# Altium schematic sheet [03] - RF_433.SchDoc
size A3; DocumentNumber: 2; SheetNumber: 2; SheetTotal: 4
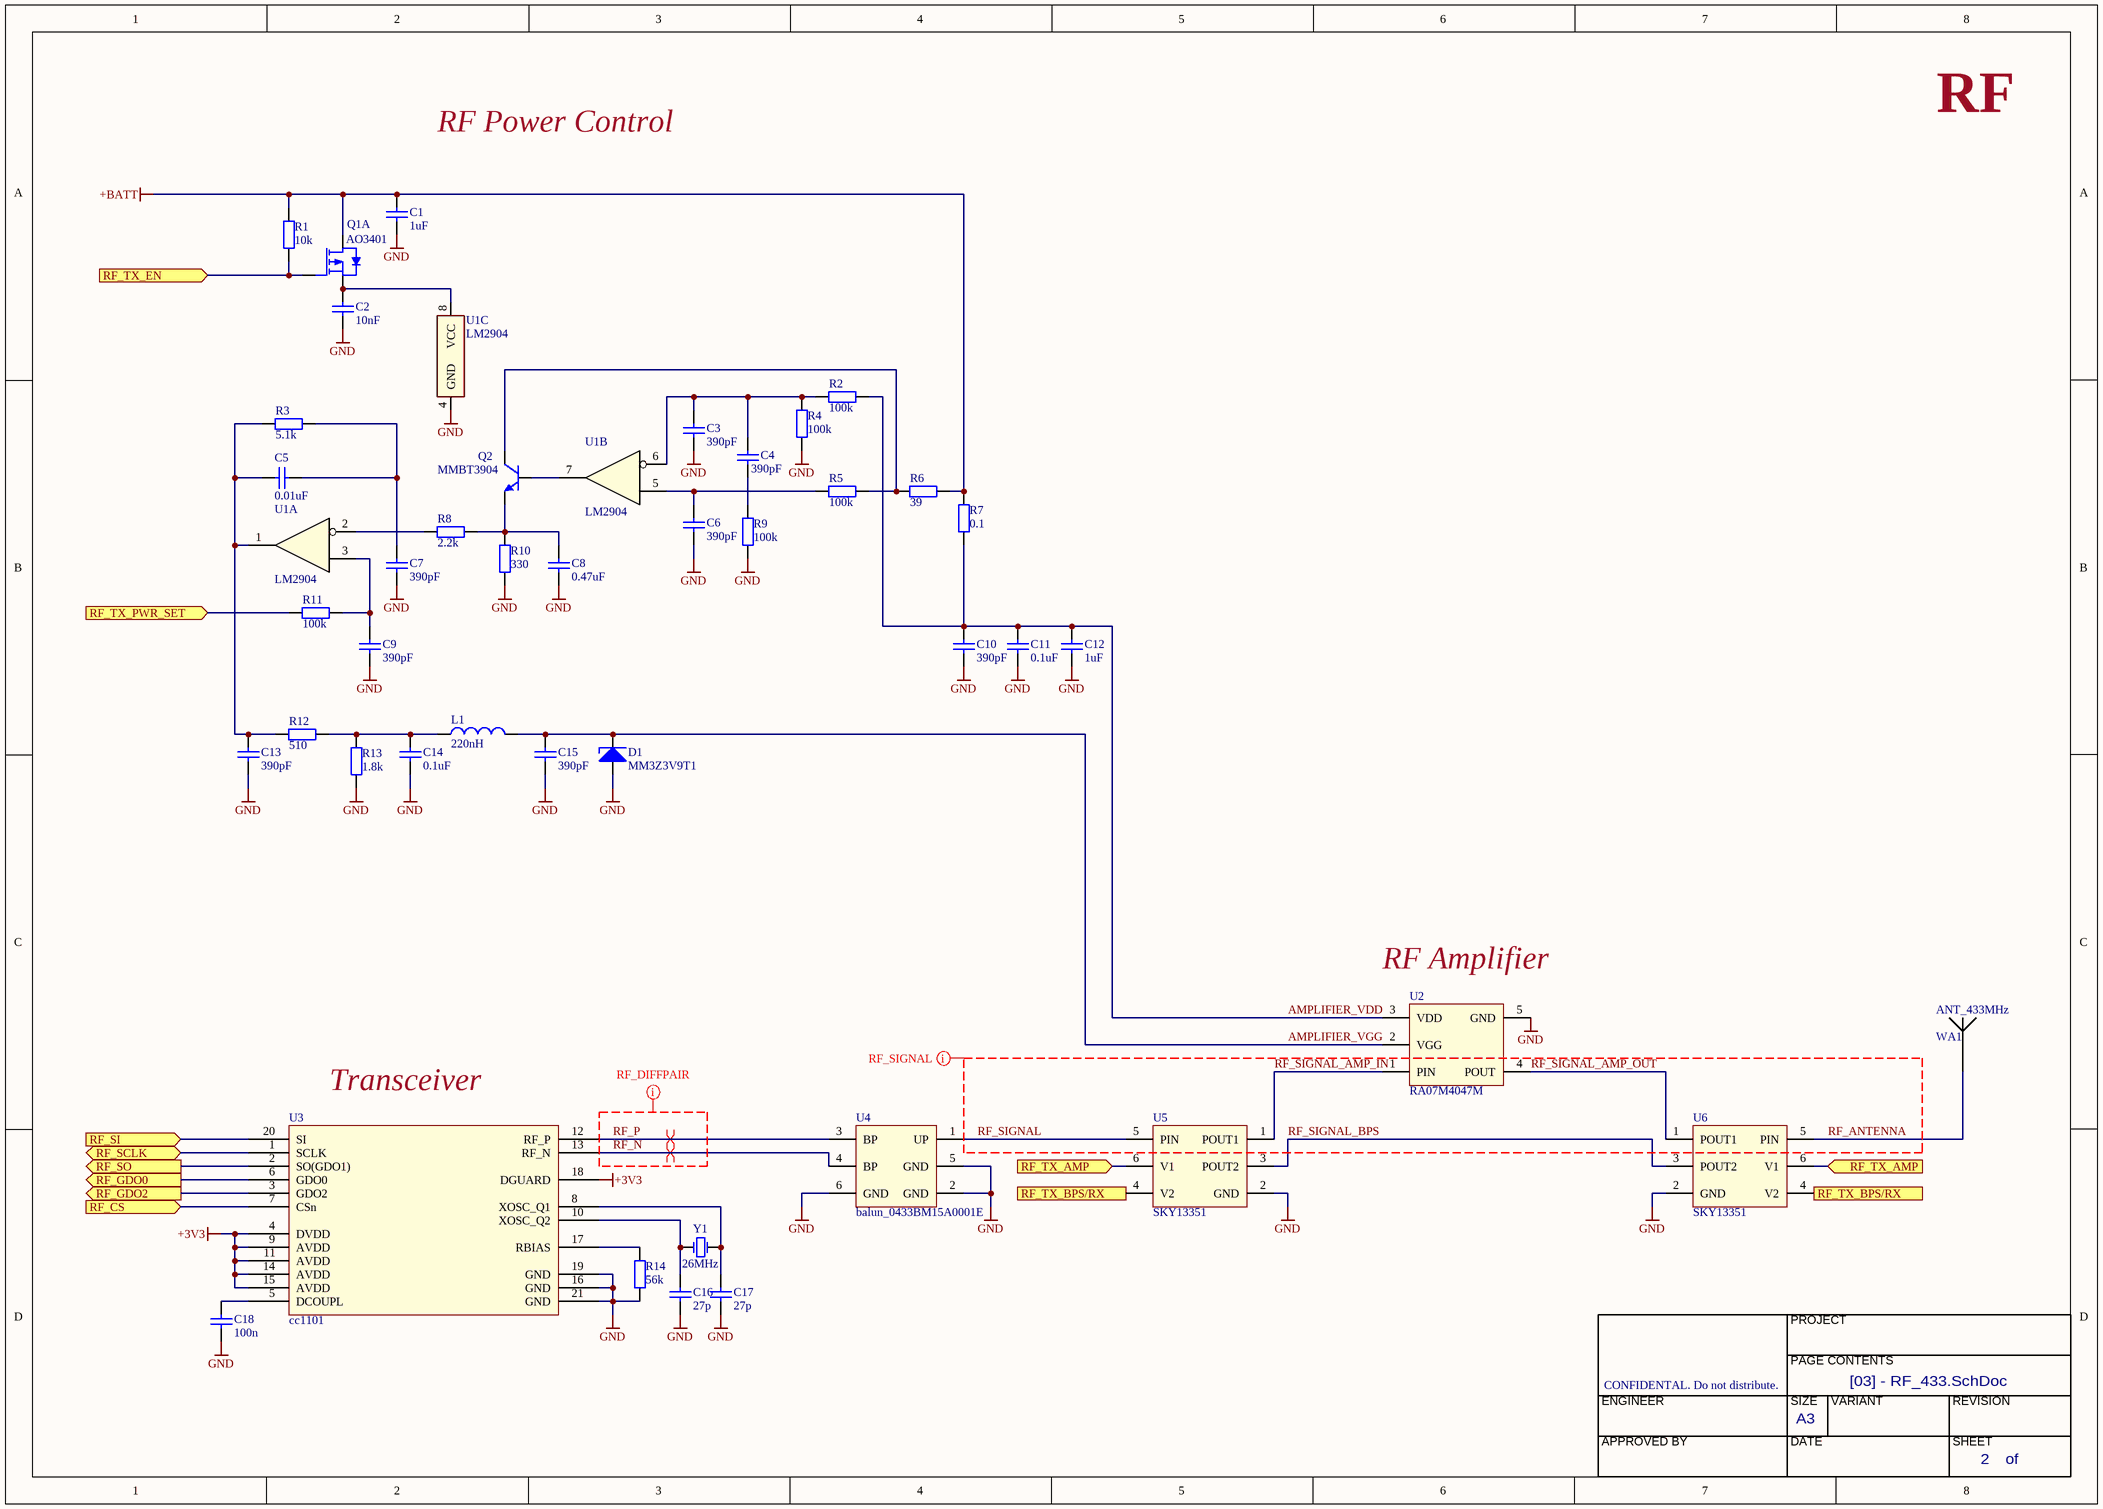
[diagram p0: [03] - RF_433.SchDoc]

## Parts
C1  1uF  [CAP0402]
C2  10nF  [CAP0402]
C3  390pF  [CAP0402]
C4  390pF  [CAP0402]
C5  0.01uF  [CAP0402]
C6  390pF  [CAP0402]
C7  390pF  [CAP0402]
C8  0.47uF  [CAP0402]
C9  390pF  [CAP0402]
C10  390pF  [CAP0402]
C11  0.1uF  [CAP0402]
C12  1uF  [CAP0402]
C13  390pF  [CAP0402]
C14  0.1uF  [CAP0402]
C15  390pF  [CAP0402]
C16  27p  [CAP0402]
C17  27p  [CAP0402]
C18  100n  [CAP0402]
D1  MM3Z3V9T1  [SOD123]
L1  220nH  [INDC0603-0201]
Q1  AO3401  [SOIC127P600-8AM]  (part A of 2)
Q2  MMBT3904  [SO-G3]
R1  10k  [RES0402]
R2  100k  [RES0805]
R3  5.1k  [RES0805]
R4  100k  [RES0805]
R5  100k  [RES0805]
R6  39  [RES0805]
R7  0.1  [RES0805]
R8  2.2k  [RES0805]
R9  100k  [RES0805]
R10  330  [RES0805]
R11  100k  [RES0805]
R12  510  [RES0805]
R13  1.8k  [RES0805]
R14  56k  [RES0805]
U1  LM2904  [SOIC8]  (parts A,B,C of 3)
U2  RA07M4047M
U3  cc1101
U4  balun_0433BM15A0001E
U5  SKY13351
U6  SKY13351
WA1  ANT_433MHz
Y1  26MHz  [HC49/4H_SMX]

## Ports
RF_CS (in), RF_GDO0 (out), RF_GDO2 (out), RF_SCLK (bidir), RF_SI (in), RF_SO (out), RF_TX_AMP (in), RF_TX_BPS/RX (in), RF_TX_EN (in), RF_TX_PWR_SET (in)

## Nets
+3V3: U3.4(DVDD) U3.9(AVDD) U3.11(AVDD) U3.14(AVDD) U3.15(AVDD) U3.18(DGUARD)
+BATT: C1.1 Q1.D1 R1.2 R6.1 R7.2
GND: C1.2 C2.1 C3.1 C6.1 C7.1 C8.1 C9.1 C10.1 C11.1 C12.1 C13.1 C14.1 C15.1 C16.2 C17.2 C18.2 D1.A R4.1 R9.1 R10.1 R13.1 R14.1 U1.4(GND) U2.5(GND) U3.16(GND) U3.19(GND) U3.21(GND) U4.2(GND) U4.5(GND) U4.6(GND) U5.2(GND) U6.2(GND)
AMPLIFIER_VDD: C10.2 C11.2 C12.2 R2.1 R7.1 U2.3(VDD)
AMPLIFIER_VGG: C15.2 D1.C L1.2 U2.2(VGG)
RF_ANTENNA: U6.5(PIN) WA1.1
RF_CS: U3.7(CSn) ; port RF_CS
RF_GDO0: U3.6(GDO0) ; port RF_GDO0
RF_GDO2: U3.3(GDO2) ; port RF_GDO2
RF_N: U3.13(RF_N) U4.4(BP)
RF_P: U3.12(RF_P) U4.3(BP)
RF_SCLK: U3.1(SCLK) ; port RF_SCLK
RF_SI: U3.20(SI) ; port RF_SI
RF_SIGNAL: U4.1(UP) U5.5(PIN)
RF_SIGNAL_AMP_IN: U2.1(PIN) U5.1(POUT1)
RF_SIGNAL_AMP_OUT: U2.4(POUT) U6.1(POUT1)
RF_SIGNAL_BPS: U5.3(POUT2) U6.3(POUT2)
RF_SO: U3.2(SO(GDO1)) ; port RF_SO
RF_TX_AMP: U5.6(V1) U6.6(V1) ; port RF_TX_AMP
RF_TX_BPS/RX: U5.4(V2) U6.4(V2) ; port RF_TX_BPS/RX
RF_TX_EN: Q1.G1 R1.1 ; port RF_TX_EN
RF_TX_PWR_SET: R11.2 ; port RF_TX_PWR_SET
NetC2_2: C2.2 Q1.S1 U1.8(VCC)
NetC3_2: C3.2 C4.2 R2.2 R4.2 U1.6(IN-)
NetC4_1: C4.1 R9.2
NetC5_1: C5.1 C7.2 R3.1
NetC5_2: C5.2 C13.2 R3.2 R12.2 U1.1(OUT)
NetC6_2: C6.2 R5.2 U1.5(IN+)
NetC8_2: C8.2 Q2.E R8.1 R10.2
NetC9_2: C9.2 R11.1 U1.3(IN+)
NetC14_2: C14.2 L1.1 R12.1 R13.2
NetC16_1: C16.1 U3.10(XOSC_Q2) Y1.1(OSC1)
NetC17_1: C17.1 U3.8(XOSC_Q1) Y1.2(OSC2)
NetC18_1: C18.1 U3.5(DCOUPL)
NetQ2_B: Q2.B U1.7(OUT)
NetQ2_C: Q2.C R5.1 R6.2
NetR8_2: R8.2 U1.2(IN-)
NetR14_2: R14.2 U3.17(RBIAS)

## Layout directives
differential pair: RF_N, RF_P
net class RF_SIGNAL: RF_ANTENNA, RF_SIGNAL, RF_SIGNAL_AMP_IN, RF_SIGNAL_AMP_OUT, RF_SIGNAL_BPS
net class RF_DIFFPAIR: RF_N, RF_P

## Notes on the sheet
- RF Power Control
- RF
- (near U2) RF Amplifier
- (near U3) Transceiver
- PROJECT
- CONFIDENTAL. Do not distribute.
- PAGE CONTENTS
- ENGINEER
- APPROVED BY
- SIZE
- DATE
- A3
- VARIANT
- REVISION
- SHEET
- of

## Library data of the parts
C1-C18 = Cap: Capacitor; Manufacturer: *; Manufacturer Part Number: *; Supplier 1: Digi-Key; Supplier Part Number 1: *
D1 = Diode_Zener: Zener Diode; pin to pad: A>1 C>2; Manufacturer: *; Manufacturer Part Number: *; Supplier 1: Digi-Key; Supplier Part Number 1: *
L1 = Inductor: DigiKey: *
Q1 = MOSFET-P dual: P-Channel Power MOSFET; pin to pad: D1>7+8 D2>5+6 G1>2 G2>4 S1>1 S2>3; DigiKey: *
Q2 = NPN: NPN Bipolar Transistor; pin to pad: B>1 C>3 E>2; Manufacturer: *; Manufacturer Part Number: *; Supplier 1: Digi-Key; Supplier Part Number 1: *
R1-R14 = Res: Resistor; Manufacturer: *; Manufacturer Part Number: *; Supplier 1: Digi-Key; Supplier Part Number 1: *
U1 = OPAMP x2
Y1 = XTAL: Crystal Oscillator; Manufacturer: *; Manufacturer Part Number: *; Supplier 1: *; Supplier Part Number 1: *